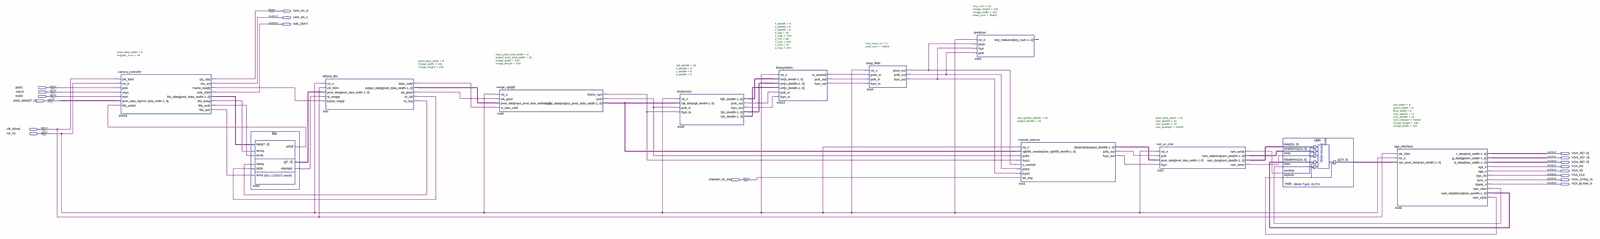
[diagram p0: schematic sheet, whole]
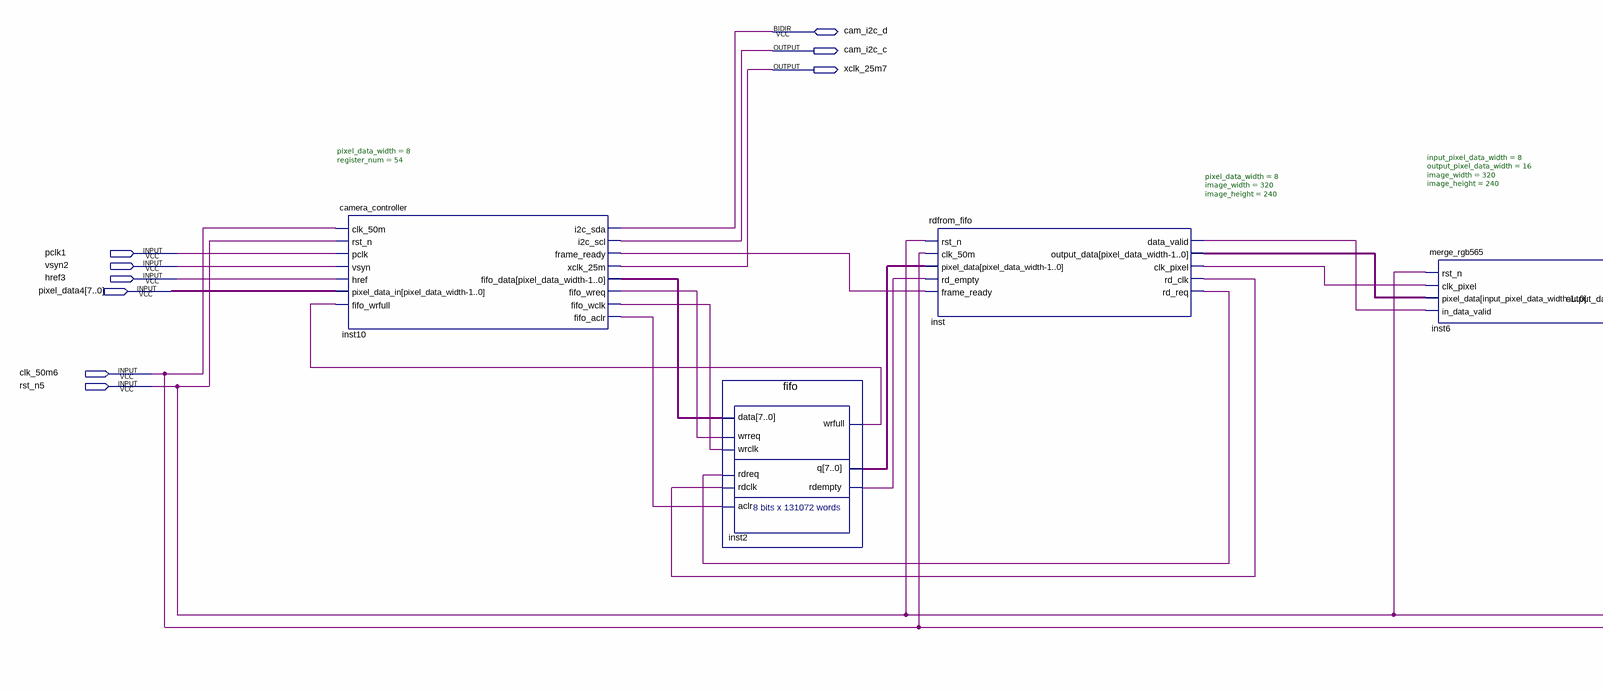
[diagram p1: schematic sheet, left part]
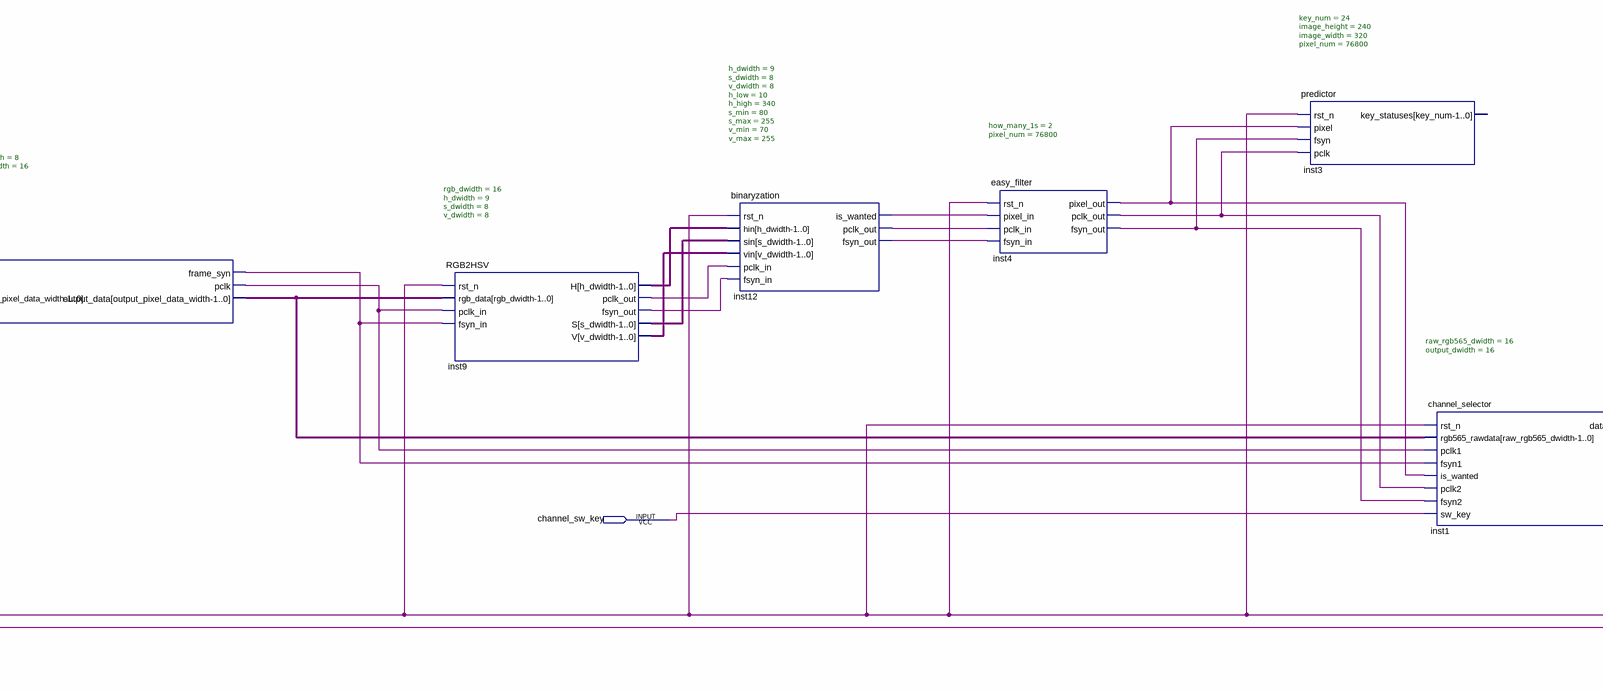
[diagram p2: schematic sheet, centre part]
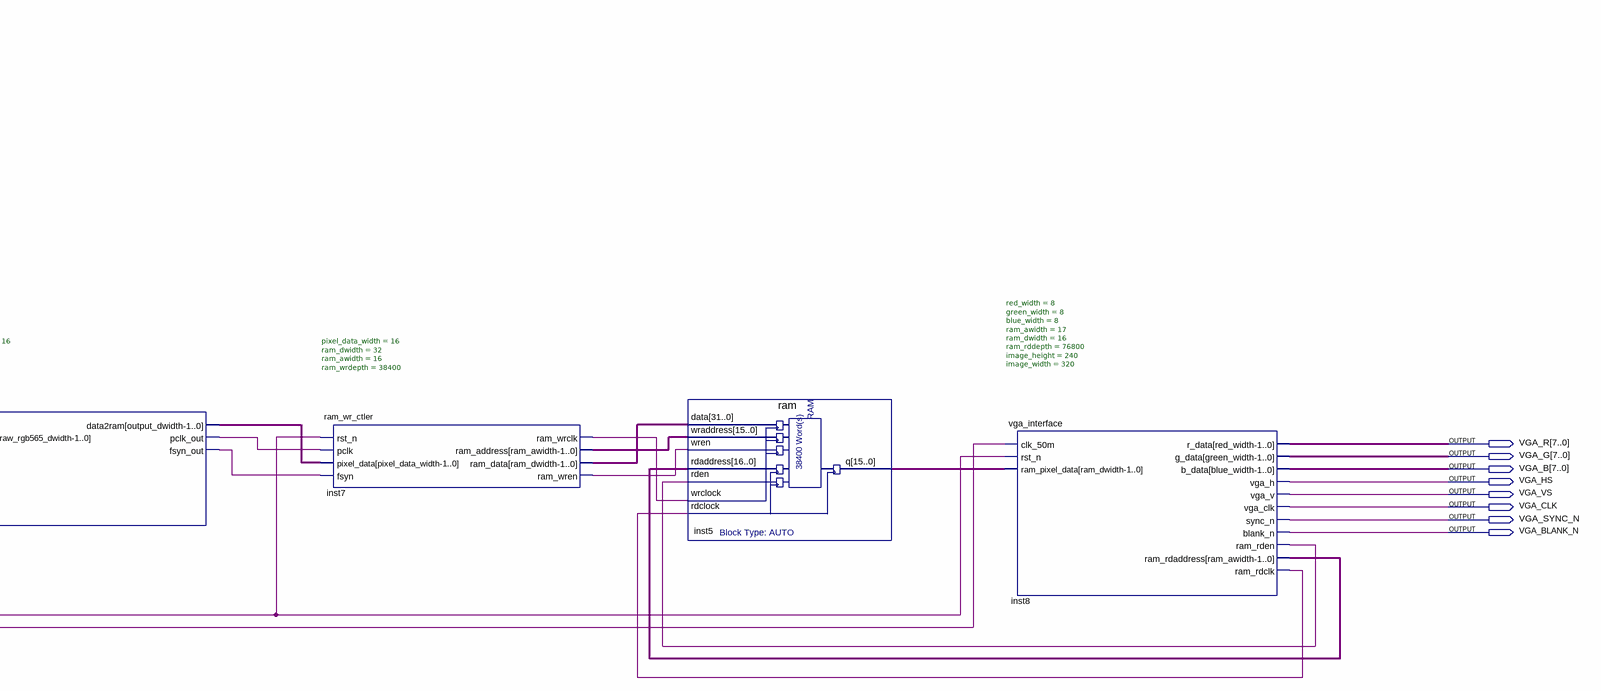
[diagram p3: schematic sheet, right part]
// Quartus schematic display_test.bdf as structural Verilog: 12 symbols, 18 pins
module display_test (
  input  pclk1,
  input  vsyn2,
  input  href3,
  input  [7:0] pixel_data4,
  input  clk_50m6,
  input  rst_n5,
  input  channel_sw_key,
  inout  cam_i2c_d,
  output cam_i2c_c,
  output xclk_25m7,
  output [7:0] VGA_R,
  output [7:0] VGA_G,
  output [7:0] VGA_B,
  output VGA_HS,
  output VGA_VS,
  output VGA_CLK,
  output VGA_SYNC_N,
  output VGA_BLANK_N
);

  wire inst1_fsyn_out, inst1_pclk_out, inst2_rdempty, inst2_wrfull, inst4_fsyn_out, inst4_pclk_out,
       inst4_pixel_out, inst6_frame_syn, inst6_pclk, inst7_ram_wrclk, inst7_ram_wren, inst8_ram_rdclk,
       inst8_ram_rden, inst9_fsyn_out, inst9_pclk_out, inst10_fifo_aclr, inst10_fifo_wclk, inst10_fifo_wreq,
       inst10_frame_ready, inst12_fsyn_out, inst12_is_wanted, inst12_pclk_out, inst_clk_pixel,
       inst_data_valid, inst_rd_clk, inst_rd_req;
  wire [7:0] inst2_q, inst9_s, inst9_v, inst10_fifo_data, inst_output_data;
  wire [8:0] inst9_h;
  wire [15:0] inst1_data2ram, inst5_q, inst6_output_data, inst7_ram_address;
  wire [16:0] inst8_ram_rdaddress;
  wire [31:0] inst7_ram_data;

  camera_controller #(.pixel_data_width(8), .register_num(54)) inst10 (
    .clk_50m(clk_50m6), .rst_n(rst_n5), .pclk(pclk1), .vsyn(vsyn2), .href(href3),
    .pixel_data_in(pixel_data4), .fifo_wrfull(inst2_wrfull), .i2c_scl(cam_i2c_c),
    .frame_ready(inst10_frame_ready), .xclk_25m(xclk_25m7), .fifo_data(inst10_fifo_data),
    .fifo_wreq(inst10_fifo_wreq), .fifo_wclk(inst10_fifo_wclk), .fifo_aclr(inst10_fifo_aclr),
    .i2c_sda(cam_i2c_d));
  fifo inst2 (
    .data(inst10_fifo_data), .wrreq(inst10_fifo_wreq), .wrclk(inst10_fifo_wclk), .rdreq(inst_rd_req),
    .rdclk(inst_rd_clk), .aclr(inst10_fifo_aclr), .wrfull(inst2_wrfull), .q(inst2_q), .rdempty(inst2_rdempty));
  rdfrom_fifo #(.pixel_data_width(8), .image_width(320), .image_height(240)) inst (
    .rst_n(rst_n5), .clk_50m(clk_50m6), .pixel_data(inst2_q), .rd_empty(inst2_rdempty),
    .frame_ready(inst10_frame_ready), .data_valid(inst_data_valid), .output_data(inst_output_data),
    .clk_pixel(inst_clk_pixel), .rd_clk(inst_rd_clk), .rd_req(inst_rd_req));
  merge_rgb565 #(.input_pixel_data_width(8), .output_pixel_data_width(16), .image_width(320), .image_height(240)) inst6 (
    .rst_n(rst_n5), .clk_pixel(inst_clk_pixel), .pixel_data(inst_output_data),
    .in_data_valid(inst_data_valid), .frame_syn(inst6_frame_syn), .pclk(inst6_pclk),
    .output_data(inst6_output_data));
  RGB2HSV #(.rgb_dwidth(16), .h_dwidth(9), .s_dwidth(8), .v_dwidth(8)) inst9 (
    .rst_n(rst_n5), .rgb_data(inst6_output_data), .pclk_in(inst6_pclk), .fsyn_in(inst6_frame_syn),
    .H(inst9_h), .pclk_out(inst9_pclk_out), .fsyn_out(inst9_fsyn_out), .S(inst9_s), .V(inst9_v));
  binaryzation #(.h_dwidth(9), .s_dwidth(8), .v_dwidth(8), .h_low(10), .h_high(340), .s_min(80), .s_max(255), .v_min(70), .v_max(255)) inst12 (
    .rst_n(rst_n5), .hin(inst9_h), .sin(inst9_s), .vin(inst9_v), .pclk_in(inst9_pclk_out),
    .fsyn_in(inst9_fsyn_out), .is_wanted(inst12_is_wanted), .pclk_out(inst12_pclk_out),
    .fsyn_out(inst12_fsyn_out));
  easy_filter #(.how_many_1s(2), .pixel_num(76800)) inst4 (
    .rst_n(rst_n5), .pixel_in(inst12_is_wanted), .pclk_in(inst12_pclk_out), .fsyn_in(inst12_fsyn_out),
    .pixel_out(inst4_pixel_out), .pclk_out(inst4_pclk_out), .fsyn_out(inst4_fsyn_out));
  predictor #(.key_num(24), .image_height(240), .image_width(320), .pixel_num(76800)) inst3 (
    .rst_n(rst_n5), .pixel(inst4_pixel_out), .fsyn(inst4_fsyn_out), .pclk(inst4_pclk_out));  // open: key_statuses
  channel_selector #(.raw_rgb565_dwidth(16), .output_dwidth(16)) inst1 (
    .rst_n(rst_n5), .rgb565_rawdata(inst6_output_data), .pclk1(inst6_pclk), .fsyn1(inst6_frame_syn),
    .is_wanted(inst4_pixel_out), .pclk2(inst4_pclk_out), .fsyn2(inst4_fsyn_out), .sw_key(channel_sw_key),
    .data2ram(inst1_data2ram), .pclk_out(inst1_pclk_out), .fsyn_out(inst1_fsyn_out));
  ram_wr_ctler #(.pixel_data_width(16), .ram_dwidth(32), .ram_awidth(16), .ram_wrdepth(38400)) inst7 (
    .rst_n(rst_n5), .pclk(inst1_pclk_out), .pixel_data(inst1_data2ram), .fsyn(inst1_fsyn_out),
    .ram_wrclk(inst7_ram_wrclk), .ram_address(inst7_ram_address), .ram_data(inst7_ram_data),
    .ram_wren(inst7_ram_wren));
  ram inst5 (
    .data(inst7_ram_data), .wraddress(inst7_ram_address), .wren(inst7_ram_wren),
    .rdaddress(inst8_ram_rdaddress), .rden(inst8_ram_rden), .wrclock(inst7_ram_wrclk),
    .rdclock(inst8_ram_rdclk), .q(inst5_q));
  vga_interface #(.red_width(8), .green_width(8), .blue_width(8), .ram_awidth(17), .ram_dwidth(16), .ram_rddepth(76800), .image_height(240), .image_width(320)) inst8 (
    .clk_50m(clk_50m6), .rst_n(rst_n5), .ram_pixel_data(inst5_q), .r_data(VGA_R), .g_data(VGA_G),
    .b_data(VGA_B), .vga_h(VGA_HS), .vga_v(VGA_VS), .vga_clk(VGA_CLK), .sync_n(VGA_SYNC_N),
    .blank_n(VGA_BLANK_N), .ram_rden(inst8_ram_rden), .ram_rdaddress(inst8_ram_rdaddress),
    .ram_rdclk(inst8_ram_rdclk));
endmodule
